# Altium schematic sheet power-supply.SchDoc
size A3
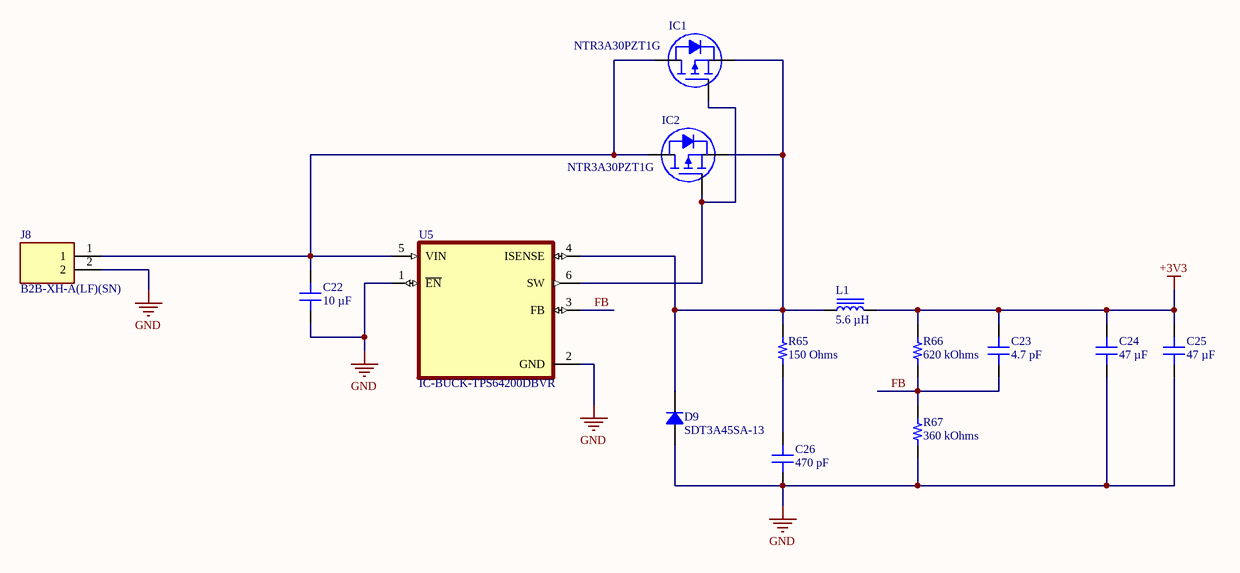
[diagram p0: power-supply.SchDoc]

## Parts
C22  10 µF  [CAP 1206_3216 - 0.8MM]
C23  4.7 pF  [CAP 0603_1608]
C24  47 µF  [CAP 0603_1608]
C25  47 µF  [CAP 1206_3216 - 0.8MM]
C26  470 pF  [CAP 0603_1608]
D9  SDT3A45SA-13  [DO214AC SMA]
IC1  NTR3A30PZT1G  [ON SEMI SOT-23-3]
IC2  NTR3A30PZT1G  [ON SEMI SOT-23-3]
J8  B2B-XH-A(LF)(SN)  [JST_B2B-XH-A(LF)(SN)]
L1  5.6 µH  [BOURNS SRP5030T]
R65  150 Ohms  [RES 1206_3216]
R66  620 kOhms  [RES 0805_2012]
R67  360 kOhms  [RES 0805_2012]
U5  IC-BUCK-TPS64200DBVR  [IC-BUCK-TPS64200DBVR-SOT95P280X145-6N]

## Nets
+3V3: C23.2 C24.2 C25.2 L1.2 R66.2
GND: C22.1 C24.1 C25.1 C26.1 D9.1 J8.2 R67.1 U5.1(~{EN}) U5.2(GND)
FB: C23.1 R66.1 R67.2 U5.3(FB)
NetC22_2: C22.2 IC1.3(D) IC2.3(D) J8.1 U5.5(VIN)
NetC26_2: C26.2 R65.1
NetD9_2: D9.2 IC1.2(S) IC2.2(S) L1.1 R65.2 U5.4(ISENSE)
NetIC1_1: IC1.1(G) IC2.1(G) U5.6(SW)

## Library data of the parts
C22 = EMK316BJ106MD-T: CAP CER 10UF 16V X5R 1206; manufacturer: Taiyo Yuden; Tolerance: ±20%; Part Number: EMK316BJ106MD-T; Value: 10 µF; Applications: SMPS Filtering; Capacitance: 10 µF; componentlink1description: Datasheet; componentlink1url: http://www.yuden.co.jp/productdata/catalog/mlcc06_e.pdf; componentlink2description: DigiKey Link; componentlink2url: https://www.digikey.com/en/products/detail/taiyo-yuden/EMK316BJ106MD-T/6563474; Device Package: 1206 (3216 Metric); lastupdated: 6/30/2022 10:09:24 PM; Lifecycle Status: Active; Minimum Order: 1; Mounting Type: Surface Mount, MLCC; Operating Temperature: -55°C ~ 85°C; Package / Case: 1206 (3216 Metric); packaging: TapeAndReel; partid: 18996; Part Status: Active; price: 0.07; series: M; Size / Dimension: 0.126" L x 0.063" W (3.20mm x 1.60mm); Supplier 1: DigiKey; Supplier Part Number 1: 587-4881-1-ND; Temperature Coefficient: X5R; Thickness (Max): 0.037" (0.95mm); Voltage - Rated: 16V
C23 = 600S4R7CT250XT: CAP CER 4.7PF 250V C0G/NP0 0603; manufacturer: American Technical Ceramics; Temperature Coefficient: C0G, NP0; Tolerance: ±0.25pF; Part Number: 600S4R7CT250XT; Value: 4.7 pF; Applications: RF, Microwave, High Frequency, Bypass, Decoupling; Capacitance: 4.7 pF; componentlink1description: Datasheet; componentlink1url: http://www.atceramics.com/UserFiles/600s.pdf; componentlink2description: DigiKey Link; componentlink2url: https://www.digikey.com/en/products/detail/american-technical-ceramics/600S4R7CT250XT/3905230; Device Package: 0603 (1608 Metric); Features: High Q, Low Loss, Ultra Low ESR; lastupdated: 6/30/2022 10:03:42 PM; Lifecycle Status: Active; Minimum Order: 1; Mounting Type: Surface Mount, MLCC; Operating Temperature: -55°C ~ 125°C; Package / Case: 0603 (1608 Metric); packaging: TapeAndReel; partid: 2945; Part Status: Active; price: 0.21; series: ATC 600S; Size / Dimension: 0.063" L x 0.032" W (1.60mm x 0.81mm); Supplier 1: DigiKey; Supplier Part Number 1: 1284-1227-1-ND; Thickness (Max): 0.035" (0.89mm); Voltage - Rated: 250V
C24 = CL10A476MR8NZNE: CAP CER 47UF 4V X5R 0603; manufacturer: Samsung Electro-Mechanics; Tolerance: ±20%; Part Number: CL10A476MR8NZNE; Value: 47 µF; Applications: General Purpose; Capacitance: 47 µF; componentlink1description: Datasheet; componentlink1url: http://www.samsungsem.com/kr/support/product-search/mlcc/CL10A476MR8NZNE.jsp; componentlink2description: DigiKey Link; componentlink2url: https://www.digikey.com/en/products/detail/samsung-electro-mechanics/CL10A476MR8NZNE/5961012; Device Package: 0603 (1608 Metric); lastupdated: 6/30/2022 10:03:30 PM; Lifecycle Status: Active; Minimum Order: 1; Mounting Type: Surface Mount, MLCC; Operating Temperature: -55°C ~ 85°C; Package / Case: 0603 (1608 Metric); packaging: TapeAndReel; partid: 6963; Part Status: Active; price: 0.46; series: CL; Size / Dimension: 0.063" L x 0.031" W (1.60mm x 0.80mm); Supplier 1: DigiKey; Supplier Part Number 1: 1276-6528-1-ND; Temperature Coefficient: X5R; Thickness (Max): 0.035" (0.90mm); Voltage - Rated: 4V
C25 = C3216X7S0J476M160AC: CAP CER 47UF 6.3V X7S 1206; manufacturer: TDK Corporation; Tolerance: ±20%; Part Number: C3216X7S0J476M160AC; Value: 47 µF; Applications: General Purpose; Capacitance: 47 µF; componentlink1description: Datasheet; componentlink1url: https://product.tdk.com/info/en/catalog/datasheets/mlcc_commercial_general_en.pdf?ref_disty=digikey; componentlink2description: DigiKey Link; componentlink2url: https://www.digikey.com/en/products/detail/tdk-corporation/C3216X7S0J476M160AC/2792275; Device Package: 1206 (3216 Metric); Features: Low ESL; lastupdated: 6/30/2022 10:09:15 PM; Lifecycle Status: Active; Minimum Order: 1; Mounting Type: Surface Mount, MLCC; Operating Temperature: -55°C ~ 125°C; Package / Case: 1206 (3216 Metric); packaging: TapeAndReel; partid: 39382; Part Status: Active; price: 0.26; series: C; Size / Dimension: 0.126" L x 0.063" W (3.20mm x 1.60mm); Supplier 1: DigiKey; Supplier Part Number 1: 445-8037-1-ND; Temperature Coefficient: X7S; Thickness (Max): 0.071" (1.80mm); Voltage - Rated: 6.3V
C26 = C0603C471J3GACAUTO: CAP CER 470PF 25V C0G/NP0 0603; manufacturer: KEMET; Temperature Coefficient: C0G, NP0; Tolerance: ±5%; Part Number: C0603C471J3GACAUTO; Value: 470 pF; Applications: Automotive; Capacitance: 470 pF; componentlink1description: Datasheet; componentlink1url: https://api.kemet.com/component-edge/download/datasheet/C0603C471J3GACAUTO.pdf; componentlink2description: DigiKey Link; componentlink2url: https://www.digikey.com/en/products/detail/kemet/C0603C471J3GACAUTO/3314886; Device Package: 0603 (1608 Metric); Features: Low ESL; lastupdated: 6/30/2022 10:03:43 PM; Lifecycle Status: Active; Minimum Order: 1; Mounting Type: Surface Mount, MLCC; Operating Temperature: -55°C ~ 125°C; Package / Case: 0603 (1608 Metric); packaging: TapeAndReel; partid: 2407; Part Status: Active; price: 0.06; Ratings: AEC-Q200; series: SMD Auto C0G; Size / Dimension: 0.063" L x 0.031" W (1.60mm x 0.80mm); Supplier 1: DigiKey; Supplier Part Number 1: 399-6891-1-ND; Thickness (Max): 0.034" (0.87mm); Voltage - Rated: 25V
D9 = SDT3A45SA-13: SCHOTTKY RECTIFIER SMA T&R 10K; Manufacturer: Diodes Incorporated; Current - Average Rectified (Io): 3A; Current - Reverse Leakage @ Vr: 280 µA @ 45 V; Speed: Fast Recovery =< 500ns, > 200mA (Io); Voltage - DC Reverse (Vr) (Max): 45 V; Voltage - Forward (Vf) (Max) @ If: 480 mV @ 3 A; Part Number: SDT3A45SA-13; ComponentLink1Description: Datasheet; ComponentLink1URL: https://www.diodes.com/assets/Datasheets/SDT3A45SA.pdf; ComponentLink2Description: DigiKey Link; ComponentLink2URL: https://www.digikey.com/en/products/detail/diodes-incorporated/SDT3A45SA-13/8537862; Diode Type: Schottky; LastUpdated: 6/30/2022 10:48:15 PM; Lifecycle Status: Active; Minimum Order: 1; Mounting Type: Surface Mount; Operating Temperature - Junction: -65°C ~ 150°C; Package / Case: DO-214AC, SMA; Packaging: TapeAndReel; PartId: 1820; Part Status: Active; Price: 0.09; Series: -; Supplier 1: DigiKey; Supplier Part Number 1: SDT3A45SA-13DICT-ND; Supplier Device Package: SMA
IC1 IC2 = NTR3A30PZT1G: MOSFET P-CH 20V 3A SOT23; Manufacturer: ON Semiconductor; Current - Continuous Drain (Id) @ 25°C: 3A (Ta); Drive Voltage (Max Rds On,  Min Rds On): 1.8V, 4.5V; FET Type: P-Channel; Gate Charge (Qg) (Max) @ Vgs: 17.6nC @ 4.5V; Input Capacitance (Ciss) (Max) @ Vds: 1651pF @ 15V; Power Dissipation (Max): 480mW (Ta); Rds On (Max) @ Id, Vgs: 38mOhm @ 3A, 4.5V; Vgs (Max): ±8V; Vgs(th) (Max) @ Id: 1V @ 250µA; Part Number: NTR3A30PZT1G; ComponentLink1Description: Datasheet; ComponentLink1URL: http://www.onsemi.com/pub/Collateral/NTR3A30PZ-D.PDF; ComponentLink2Description: DigiKey Link; ComponentLink2URL: http://digikey.com/product-detail/en/on-semiconductor/NTR3A30PZT1G/NTR3A30PZT1GOSCT-ND/5723269; Drain to Source Voltage (Vdss): 20V; LastUpdated: 6/30/2022 10:59:40 PM; Lifecycle Status: Active; Minimum Order: 1; Mounting Type: Surface Mount; Operating Temperature: -55°C ~ 150°C (TJ); Package / Case: TO-236-3, SC-59, SOT-23-3; Packaging: TapeAndReel; Part Status: Active; Price: 0.23; Series: -; Supplier 1: DigiKey; Supplier Part Number 1: NTR3A30PZT1GOSCT-ND; Supplier Device Package: SOT-23-3 (TO-236); Technology: MOSFET (Metal Oxide)
J8 = B2B-XH-A(LF)(SN): Connector Header Through Hole 2 position 0.098" (2.50mm); MF: {'manufacturer': u'JST Sales'}; Price: None; Value: *; Package: None; Availability: Unavailable; MP: B2B-XH-A(LF)(SN)
L1 = SRP5030T-5R6M: FIXED IND 5.6UH 4.25A 63MOHM SMD; Manufacturer: Bourns Inc.; Current - Saturation: 4.5A; DC Resistance (DCR): 63mOhm Max; Inductance Frequency - Test: 100 kHz; Material - Core: Iron Powder; Shielding: Shielded; Tolerance: ±20%; Type: Drum Core, Wirewound; Part Number: SRP5030T-5R6M; ComponentLink1Description: Datasheet; ComponentLink1URL: https://www.bourns.com/docs/Product-Datasheets/SRP5030T.pdf; ComponentLink2Description: DigiKey Link; ComponentLink2URL: https://www.digikey.com/en/products/detail/bourns-inc/SRP5030T-5R6M/3986085; Current Rating (Amps): 4.25 A; Device Package: Nonstandard; Height - Seated (Max): 0.118" (3.00mm); Inductance: 5.6 µH; LastUpdated: 6/30/2022 10:52:36 PM; Lifecycle Status: Active; Minimum Order: 1; Mounting Type: Surface Mount; Operating Temperature: -40°C ~ 125°C; Package / Case: Nonstandard; Packaging: TapeAndReel; PartId: 10; Part Status: Active; Price: 0.66; Series: SRP5030T; Size / Dimension: 0.224" L x 0.205" W (5.70mm x 5.20mm); Supplier 1: DigiKey; Supplier Part Number 1: SRP5030T-5R6MCT-ND; Value: 5.6 µH
R65 = RT1206BRD07150RL: RES SMD 150 OHM 0.1% 1/4W 1206; Manufacturer: Yageo; Power (Watts): 0.25W, 1/4W; Temperature Coefficient: ±25ppm/°C; Part Number: RT1206BRD07150RL; ComponentLink1Description: Datasheet; ComponentLink1URL: https://www.yageo.com/upload/media/product/productsearch/datasheet/rchip/PYu-RT_1-to-0.01_RoHS_L_11.pdf; ComponentLink2Description: DigiKey Link; ComponentLink2URL: https://www.digikey.com/en/products/detail/yageo/RT1206BRD07150RL/1079534; Composition: Thin Film; Device Package: 1206 (3216 Metric); Height - Seated (Max): 0.026" (0.65mm); LastUpdated: 6/30/2022 10:32:38 PM; Lifecycle Status: Active; Minimum Order: 1; Number of Terminations: 2; Operating Temperature: -55°C ~ 155°C; Package / Case: 1206 (3216 Metric); Packaging: TapeAndReel; PartId: 26861; Part Status: Active; Price: 0.10; Resistance: 150 Ohms; Series: RT; Size / Dimension: 0.122" L x 0.063" W (3.10mm x 1.60mm); Supplier 1: DigiKey; Supplier Part Number 1: YAG5032CT-ND; Supplier Device Package: 1206; Tolerance: ±0.1%; Value: 150 Ohms
R66 = RMCF0805JT620K: RES 620K OHM 5% 1/8W 0805; Manufacturer: Stackpole Electronics Inc; Power (Watts): 0.125W, 1/8W; Temperature Coefficient: ±200ppm/°C; Part Number: RMCF0805JT620K; Value: 620 kOhms; ComponentLink1Description: Datasheet; ComponentLink1URL: https://www.seielect.com/catalog/sei-rmcf_rmcp.pdf; ComponentLink2Description: DigiKey Link; ComponentLink2URL: https://www.digikey.com/en/products/detail/stackpole-electronics-inc/RMCF0805JT620K/1757918; Composition: Thick Film; Device Package: 0805 (2012 Metric); Features: Automotive AEC-Q200; Height - Seated (Max): 0.026" (0.65mm); LastUpdated: 6/30/2022 10:39:22 PM; Lifecycle Status: Active; Minimum Order: 1; Number of Terminations: 2; Operating Temperature: -55°C ~ 155°C; Package / Case: 0805 (2012 Metric); Packaging: CutTape; PartId: 29602; Part Status: Active; Price: 0.01; Ratings: AEC-Q200; Resistance: 620 kOhms; Series: RMCF; Size / Dimension: 0.079" L x 0.049" W (2.00mm x 1.25mm); Supplier 1: DigiKey; Supplier Part Number 1: RMCF0805JT620KCT-ND; Supplier Device Package: 0805; Tolerance: ±5%
R67 = RC0805JR-07360KL: RES 360K OHM 5% 1/8W 0805; Manufacturer: Yageo; Power (Watts): 0.125W, 1/8W; Temperature Coefficient: ±100ppm/°C; Part Number: RC0805JR-07360KL; Value: 360 kOhms; ComponentLink1Description: Datasheet; ComponentLink1URL: https://www.yageo.com/upload/media/product/productsearch/datasheet/rchip/PYu-RC_Group_51_RoHS_L_10.pdf; ComponentLink2Description: DigiKey Link; ComponentLink2URL: https://www.digikey.com/en/products/detail/yageo/RC0805JR-07360KL/728316; Composition: Thick Film; Device Package: 0805 (2012 Metric); Features: Moisture Resistant; Height - Seated (Max): 0.024" (0.60mm); LastUpdated: 6/30/2022 10:39:22 PM; Lifecycle Status: Active; Minimum Order: 1; Number of Terminations: 2; Operating Temperature: -55°C ~ 155°C; Package / Case: 0805 (2012 Metric); Packaging: CutTape; PartId: 29612; Part Status: Active; Price: 0.01; Resistance: 360 kOhms; Series: RC_L; Size / Dimension: 0.079" L x 0.049" W (2.00mm x 1.25mm); Supplier 1: DigiKey; Supplier Part Number 1: 311-360KARCT-ND; Supplier Device Package: 0805; Tolerance: ±5%
U5 = IC-BUCK-TPS64200DBVR: 1.8 to 6.5 V input, 350 kHz, 95% efficient step-down controller, 20 uA, SOT-23 6-SOT-23 -40 to 85; MF: Texas Instruments; SnapEDA_Link: https://www.snapeda.com/parts/TPS64200DBVR/Texas+Instruments/view-part/?ref=snap; Package: SOT-23-6 Texas Instruments; Availability: In Stock; Price: None; Purchase-URL: https://pricing.snapeda.com/search/part/TPS64200DBVR/?ref=eda; Check_prices: https://www.snapeda.com/parts/TPS64200DBVR/Texas+Instruments/view-part/?ref=eda; MP: TPS64200DBVR; Value: *